# Altium project equalizerAndVoltageControl.PrjPcb
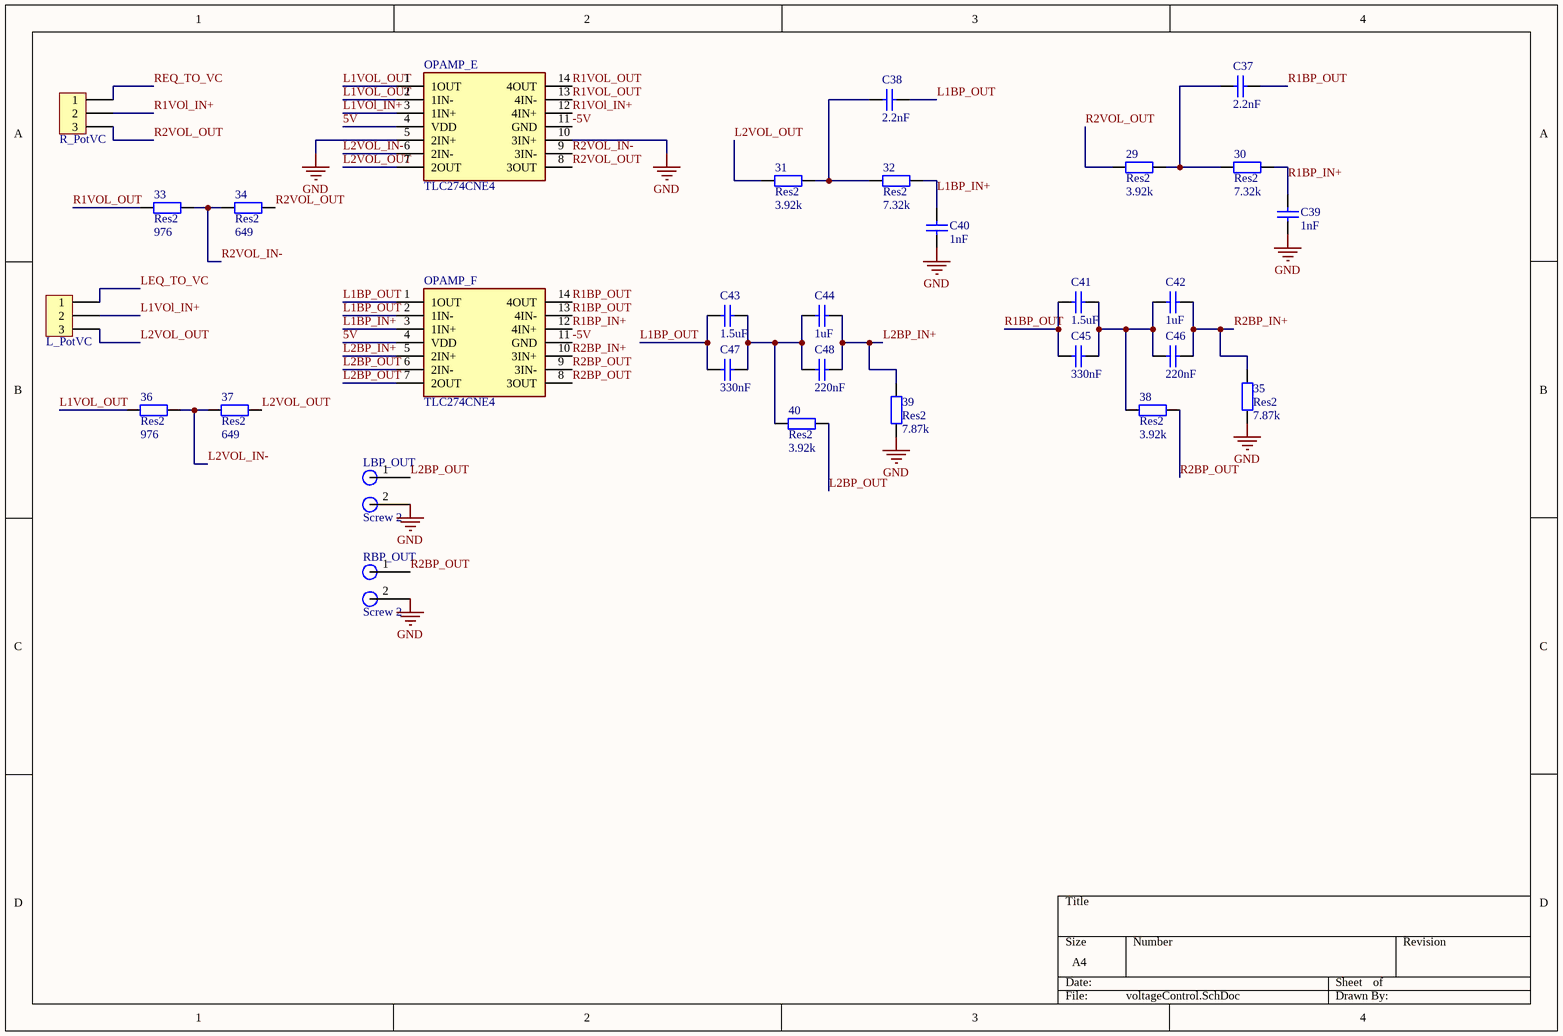
[diagram p0: voltageControl.SchDoc]
2 sheets, 121 parts. Net scope: global (net labels, ports and power ports of the same name join across sheets).
Board files: eqVcVersion1.PcbDoc, eqVcVersion2.PcbDoc
Sheets:
  voltageControl.SchDoc
  equalizer.SchDoc

## Sheet voltageControl.SchDoc
size A4; SheetNumber: 1; SheetTotal: 2

### Parts
29  Res2  value 3.92k  [AXIAL-0.4 PCBK]
30  Res2  value 7.32k  [AXIAL-0.4 PCBK]
31  Res2  value 3.92k  [AXIAL-0.4 PCBK]
32  Res2  value 7.32k  [AXIAL-0.4 PCBK]
33  Res2  value 976  [AXIAL-0.4 PCBK]
34  Res2  value 649  [AXIAL-0.4 PCBK]
35  Res2  value 7.87k  [AXIAL-0.4 PCBK]
36  Res2  value 976  [AXIAL-0.4 PCBK]
37  Res2  value 649  [AXIAL-0.4 PCBK]
38  Res2  value 3.92k  [AXIAL-0.4 PCBK]
39  Res2  value 7.87k  [AXIAL-0.4 PCBK]
40  Res2  value 3.92k  [AXIAL-0.4 PCBK]
C37  Capacity: 2.2nF  [Cap-1]  (hidden comment: Cap)
C38  Capacity: 2.2nF  [Cap-1]  (hidden comment: Cap)
C39  Capacity: 1nF  [Cap-1]  (hidden comment: Cap)
C40  Capacity: 1nF  [Cap-1]  (hidden comment: Cap)
C41  Capacity: 1.5uF  [Cap-1]  (hidden comment: Cap)
C42  Capacity: 1uF  [Cap-1]  (hidden comment: Cap)
C43  Capacity: 1.5uF  [Cap-1]  (hidden comment: Cap)
C44  Capacity: 1uF  [Cap-1]  (hidden comment: Cap)
C45  Capacity: 330nF  [Cap 20mm]  (hidden comment: Cap)
C46  Capacity: 220nF  [Cap-1]  (hidden comment: Cap)
C47  Capacity: 330nF  [Cap 20mm]  (hidden comment: Cap)
C48  Capacity: 220nF  [Cap-1]  (hidden comment: Cap)
L_PotVC  Header 1x3  [Header 1x3]  (value not drawn)
LBP_OUT  Screw 2  [Screw-2]
OPAMP_E  TLC274CNE4  [DIP794W53P254L1930H508Q14N]
OPAMP_F  TLC274CNE4  [DIP794W53P254L1930H508Q14N]
R_PotVC  Header 1x3  [Header 1x3]  (value not drawn)
RBP_OUT  Screw 2  [Screw-2]

### Nets
GND: 35.1 39.1 C39.1 C40.1 LBP_OUT.2 OPAMP_E.5(2IN+) OPAMP_E.10(3IN+) RBP_OUT.2
5V: OPAMP_E.4(VDD) OPAMP_F.4(VDD)
-5V: OPAMP_E.11(GND) OPAMP_F.11(GND)
L1BP_IN+: 32.2 C40.2(g) OPAMP_F.3(1IN+)
L1BP_OUT: C38.2(g) C43.1 C47.1 OPAMP_F.1(1OUT) OPAMP_F.2(1IN-)
L1VOl_IN+: L_PotVC.2 OPAMP_E.3(1IN+)
L1VOL_OUT: 36.1 OPAMP_E.1(1OUT) OPAMP_E.2(1IN-)
L2BP_IN+: 39.2 C44.2(g) C48.2(g) OPAMP_F.5(2IN+)
L2BP_OUT: 40.2 LBP_OUT.1 OPAMP_F.6(2IN-) OPAMP_F.7(2OUT)
L2VOL_IN-: 36.2 37.1 OPAMP_E.6(2IN-)
L2VOL_OUT: 31.1 37.2 L_PotVC.3 OPAMP_E.7(2OUT)
LEQ_TO_VC: L_PotVC.1
R1BP_IN+: 30.2 C39.2(g) OPAMP_F.12(4IN+)
R1BP_OUT: C37.2(g) C41.1 C45.1 OPAMP_F.13(4IN-) OPAMP_F.14(4OUT)
R1VOl_IN+: OPAMP_E.12(4IN+) R_PotVC.2
R1VOL_OUT: 33.1 OPAMP_E.13(4IN-) OPAMP_E.14(4OUT)
R2BP_IN+: 35.2 C42.2(g) C46.2(g) OPAMP_F.10(3IN+)
R2BP_OUT: 38.2 OPAMP_F.8(3OUT) OPAMP_F.9(3IN-) RBP_OUT.1
R2VOL_IN-: 33.2 34.1 OPAMP_E.9(3IN-)
R2VOL_OUT: 29.1 34.2 OPAMP_E.8(3OUT) R_PotVC.3
REQ_TO_VC: R_PotVC.1
Net29_2: 29.2 30.1 C37.1
Net31_2: 31.2 32.1 C38.1
Net38_1: 38.1 C41.2(g) C42.1 C45.2(g) C46.1
Net40_1: 40.1 C43.2(g) C44.1 C47.2(g) C48.1

### Library data of the parts
29-40 = Res PCBK: Resistor; Published: 8-Jun-2000; LatestRevisionDate: 17-Jul-2002; LatestRevisionNote: Re-released for DXP Platform.; PackageReference: AXIAL-0.4; Publisher: Altium Limited
C37-C44 C46 C48 = Capacitor 1 space
C45 C47 = Capacitor big ceramic
OPAMP_E OPAMP_F = TLC274CNE4: Precision Amplifiers Quad Single Supply Op Amp; Manufacturer_Name: Texas Instruments; Geometry.Height: 5.08mm; Mouser Part Number: 595-TLC274CNE4; Mouser Price/Stock: https://www.mouser.co.uk/ProductDetail/Texas-Instruments/TLC274CNE4?qs=Mkt%2FZhxPIiTvMsNXR1cCkw%3D%3D; Manufacturer_Part_Number: TLC274CNE4; Datasheet Link: https://www.ti.com/lit/ds/symlink/tlc274.pdf?ts=1639464334605&ref_url=https%253A%252F%252Fwww.ti.com%252Fstore%252Fti%252Fen%252Fp%252Fproduct%252F%253Fp%253DTLC274CN

## Sheet equalizer.SchDoc
size A4; SheetNumber: 2; SheetTotal: 2
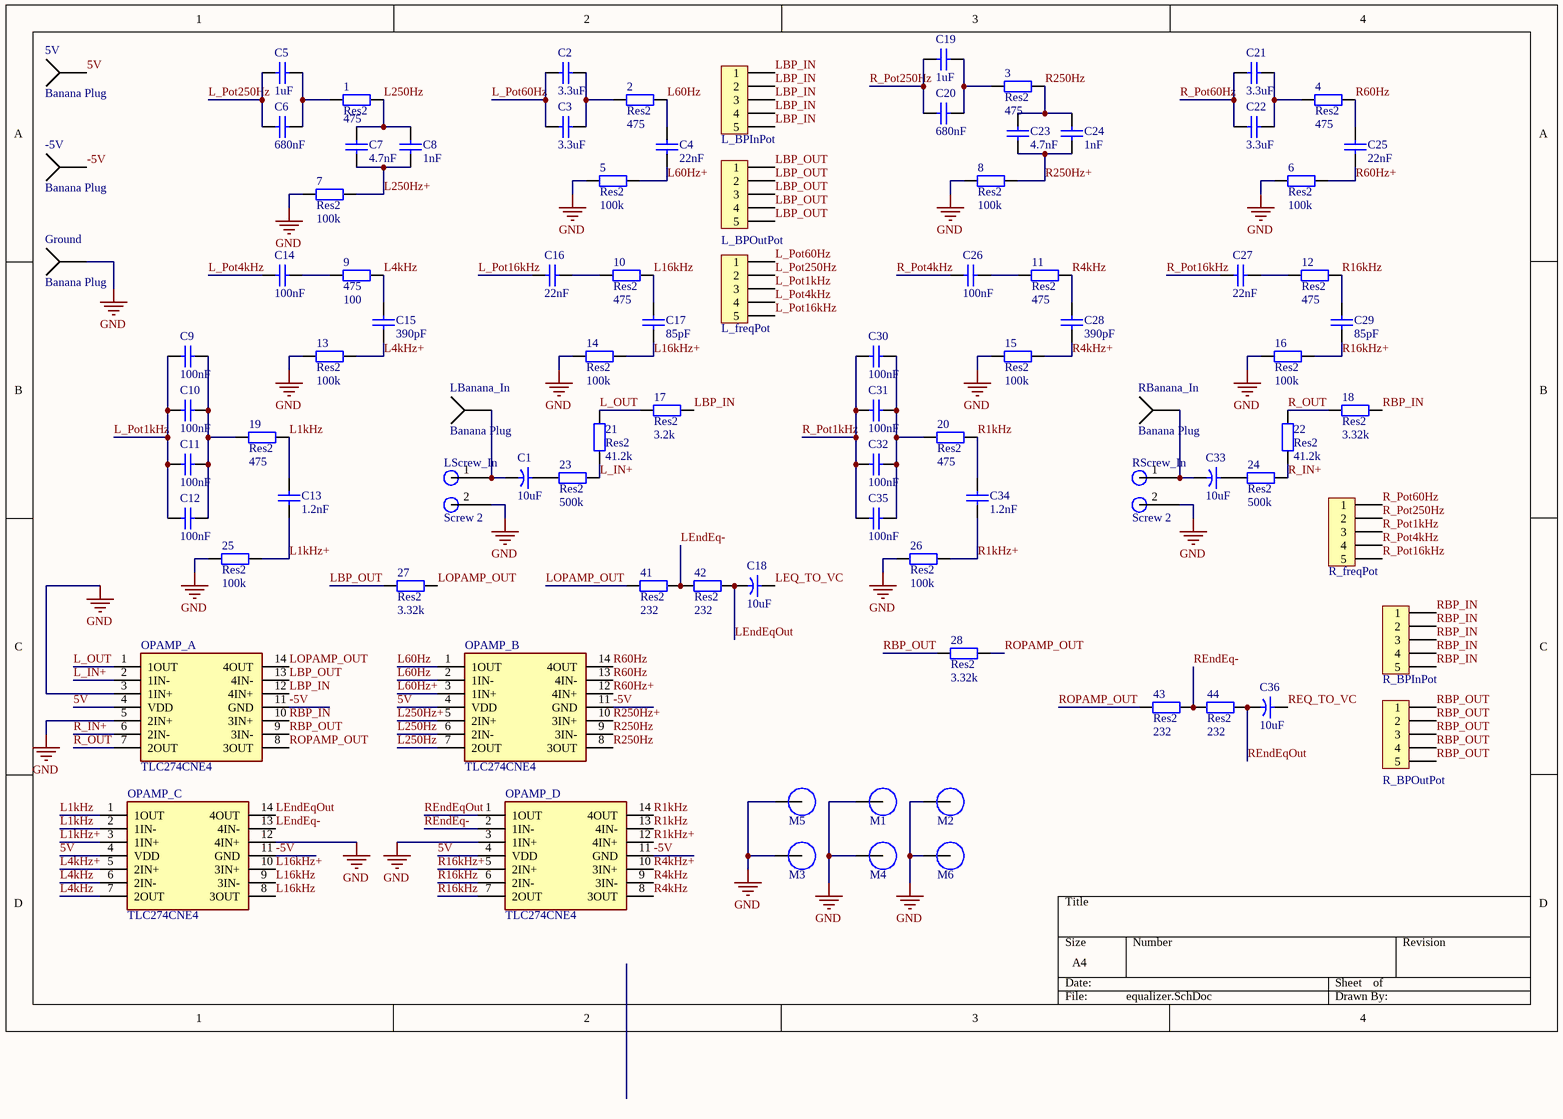
[diagram p1: equalizer.SchDoc]

### Parts
1  Res2  value 475  [AXIAL-0.4 PCBK]
2  Res2  value 475  [AXIAL-0.4 PCBK]
3  Res2  value 475  [AXIAL-0.4 PCBK]
4  Res2  value 475  [AXIAL-0.4 PCBK]
5  Res2  value 100k  [AXIAL-0.4 PCBK]
5V  Banana Plug  [Banana Plug On top]
6  Res2  value 100k  [AXIAL-0.4 PCBK]
7  Res2  value 100k  [AXIAL-0.4 PCBK]
8  Res2  value 100k  [AXIAL-0.4 PCBK]
9  475  value 100  [AXIAL-0.4 PCBK]
10  Res2  value 475  [AXIAL-0.4 PCBK]
11  Res2  value 475  [AXIAL-0.4 PCBK]
12  Res2  value 475  [AXIAL-0.4 PCBK]
13  Res2  value 100k  [AXIAL-0.4 PCBK]
14  Res2  value 100k  [AXIAL-0.4 PCBK]
15  Res2  value 100k  [AXIAL-0.4 PCBK]
16  Res2  value 100k  [AXIAL-0.4 PCBK]
17  Res2  value 3.2k  [AXIAL-0.4 PCBK]
18  Res2  value 3.32k  [AXIAL-0.4 PCBK]
19  Res2  value 475  [AXIAL-0.4 PCBK]
20  Res2  value 475  [AXIAL-0.4 PCBK]
21  Res2  value 41.2k  [AXIAL-0.4 PCBK]
22  Res2  value 41.2k  [AXIAL-0.4 PCBK]
23  Res2  value 500k  [AXIAL-0.4 PCBK]
24  Res2  value 500k  [AXIAL-0.4 PCBK]
25  Res2  value 100k  [AXIAL-0.4 PCBK]
26  Res2  value 100k  [AXIAL-0.4 PCBK]
27  Res2  value 3.32k  [AXIAL-0.4 PCBK]
28  Res2  value 3.32k  [AXIAL-0.4 PCBK]
41  Res2  value 232  [AXIAL-0.4 PCBK]
42  Res2  value 232  [AXIAL-0.4 PCBK]
43  Res2  value 232  [AXIAL-0.4 PCBK]
44  Res2  value 232  [AXIAL-0.4 PCBK]
-5V  Banana Plug  [Banana Plug On top]
C1  Capacity: 10uF  [RES THT 9mm]  (hidden comment: Cap)
C2  Capacity: 3.3uF  [Cap 20mm]  (hidden comment: Cap)
C3  Capacity: 3.3uF  [Cap 20mm]  (hidden comment: Cap)
C4  Capacity: 22nF  [Cap-1]  (hidden comment: Cap)
C5  Capacity: 1uF  [Cap-1]  (hidden comment: Cap)
C6  Capacity: 680nF  [Cap-1]  (hidden comment: Cap)
C7  Capacity: 4.7nF  [Cap-0]  (hidden comment: Cap)
C8  Capacity: 1nF  [Cap-0]  (hidden comment: Cap)
C9  Capacity: 100nF  [Cap-1]  (hidden comment: Cap)
C10  Capacity: 100nF  [Cap-1]  (hidden comment: Cap)
C11  Capacity: 100nF  [Cap-1]  (hidden comment: Cap)
C12  Capacity: 100nF  [Cap-1]  (hidden comment: Cap)
C13  Capacity: 1.2nF  [Cap-1]  (hidden comment: Cap)
C14  Capacity: 100nF  [Cap-1]  (hidden comment: Cap)
C15  Capacity: 390pF  [Cap-0]  (hidden comment: Cap)
C16  Capacity: 22nF  [Cap-1]  (hidden comment: Cap)
C17  Capacity: 85pF  [Cap-0]  (hidden comment: Cap)
C18  Capacity: 10uF  [RES THT 9mm]  (hidden comment: Cap)
C19  Capacity: 1uF  [Cap-1]  (hidden comment: Cap)
C20  Capacity: 680nF  [Cap-1]  (hidden comment: Cap)
C21  Capacity: 3.3uF  [Cap 20mm]  (hidden comment: Cap)
C22  Capacity: 3.3uF  [Cap 20mm]  (hidden comment: Cap)
C23  Capacity: 4.7nF  [Cap-0]  (hidden comment: Cap)
C24  Capacity: 1nF  [Cap-0]  (hidden comment: Cap)
C25  Capacity: 22nF  [Cap-1]  (hidden comment: Cap)
C26  Capacity: 100nF  [Cap-1]  (hidden comment: Cap)
C27  Capacity: 22nF  [Cap-1]  (hidden comment: Cap)
C28  Capacity: 390pF  [Cap-0]  (hidden comment: Cap)
C29  Capacity: 85pF  [Cap-0]  (hidden comment: Cap)
C30  Capacity: 100nF  [Cap-1]  (hidden comment: Cap)
C31  Capacity: 100nF  [Cap-1]  (hidden comment: Cap)
C32  Capacity: 100nF  [Cap-1]  (hidden comment: Cap)
C33  Capacity: 10uF  [RES THT 9mm]  (hidden comment: Cap)
C34  Capacity: 1.2nF  [Cap-1]  (hidden comment: Cap)
C35  Capacity: 100nF  [Cap-1]  (hidden comment: Cap)
C36  Capacity: 10uF  [RES THT 9mm]  (hidden comment: Cap)
Ground  Banana Plug  [Banana Plug On top]
L_BPInPot  Header 1x5  [Header 1x5]  (value not drawn)
L_BPOutPot  Header 1x5  [Header 1x5]  (value not drawn)
L_freqPot  Header 1x5  [Header 1x5]  (value not drawn)
LBanana_In  Banana Plug  [Banana Plug On top]
LScrew_In  Screw 2  [Screw-2]
M1  Screw Hole  [M8 HOLE]  (value not drawn)
M2  Screw Hole  [M8 HOLE]  (value not drawn)
M3  Screw Hole  [M8 HOLE]  (value not drawn)
M4  Screw Hole  [M8 HOLE]  (value not drawn)
M5  Screw Hole  [M8 HOLE]  (value not drawn)
M6  Screw Hole  [M8 HOLE]  (value not drawn)
OPAMP_A  TLC274CNE4  [DIP794W53P254L1930H508Q14N]
OPAMP_B  TLC274CNE4  [DIP794W53P254L1930H508Q14N]
OPAMP_C  TLC274CNE4  [DIP794W53P254L1930H508Q14N]
OPAMP_D  TLC274CNE4  [DIP794W53P254L1930H508Q14N]
R_BPInPot  Header 1x5  [Header 1x5]  (value not drawn)
R_BPOutPot  Header 1x5  [Header 1x5]  (value not drawn)
R_freqPot  Header 1x5  [Header 1x5]  (value not drawn)
RBanana_In  Banana Plug  [Banana Plug On top]
RScrew_In  Screw 2  [Screw-2]

### Nets
GND: 5.1 6.1 7.1 8.1 13.1 14.1 15.1 16.1 25.1 26.1 Ground.1 LScrew_In.2 M1.1 M2.1 M3.1 M4.1 M5.1 M6.1 OPAMP_A.3(1IN+) OPAMP_A.5(2IN+) OPAMP_C.12(4IN+) OPAMP_D.3(1IN+) RScrew_In.2
5V: 5V.1 OPAMP_A.4(VDD) OPAMP_B.4(VDD) OPAMP_C.4(VDD) OPAMP_D.4(VDD)
-5V: -5V.1 OPAMP_A.11(GND) OPAMP_B.11(GND) OPAMP_C.11(GND) OPAMP_D.11(GND)
L1kHz: 19.2 C13.2(g) OPAMP_C.1(1OUT) OPAMP_C.2(1IN-)
L1kHz+: 25.2 C13.1 OPAMP_C.3(1IN+)
L4kHz: 9.2 C15.2(g) OPAMP_C.6(2IN-) OPAMP_C.7(2OUT)
L4kHz+: 13.2 C15.1 OPAMP_C.5(2IN+)
L16kHz: 10.2 C17.2(g) OPAMP_C.8(3OUT) OPAMP_C.9(3IN-)
L16kHz+: 14.2 C17.1 OPAMP_C.10(3IN+)
L60Hz: 2.2 C4.2(g) OPAMP_B.1(1OUT) OPAMP_B.2(1IN-)
L60Hz+: 5.2 C4.1 OPAMP_B.3(1IN+)
L250Hz: 1.2 C7.2(g) C8.2(g) OPAMP_B.6(2IN-) OPAMP_B.7(2OUT)
L250Hz+: 7.2 C7.1 C8.1 OPAMP_B.5(2IN+)
L_IN+: 21.1 23.2 OPAMP_A.2(1IN-)
L_OUT: 17.1 21.2 OPAMP_A.1(1OUT)
L_Pot1kHz: C9.1 C10.1 C11.1 C12.1 L_freqPot.3
L_Pot4kHz: C14.1 L_freqPot.4
L_Pot16kHz: C16.1 L_freqPot.5
L_Pot60Hz: C2.1 C3.1 L_freqPot.1
L_Pot250Hz: C5.2(g) C6.2(g) L_freqPot.2
LBP_IN: 17.2 L_BPInPot.1 L_BPInPot.2 L_BPInPot.3 L_BPInPot.4 L_BPInPot.5 OPAMP_A.12(4IN+)
LBP_OUT: 27.1 L_BPOutPot.1 L_BPOutPot.2 L_BPOutPot.3 L_BPOutPot.4 L_BPOutPot.5 OPAMP_A.13(4IN-)
LEndEq-: 41.2 42.1 OPAMP_C.13(4IN-)
LEndEqOut: 42.2 C18.2(g) OPAMP_C.14(4OUT)
LEQ_TO_VC: C18.1
LOPAMP_OUT: 27.2 41.1 OPAMP_A.14(4OUT)
R1kHz: 20.2 C34.2(g) OPAMP_D.13(4IN-) OPAMP_D.14(4OUT)
R1kHz+: 26.2 C34.1 OPAMP_D.12(4IN+)
R4kHz: 11.2 C28.2(g) OPAMP_D.8(3OUT) OPAMP_D.9(3IN-)
R4kHz+: 15.2 C28.1 OPAMP_D.10(3IN+)
R16kHz: 12.2 C29.2(g) OPAMP_D.6(2IN-) OPAMP_D.7(2OUT)
R16kHz+: 16.2 C29.1 OPAMP_D.5(2IN+)
R60Hz: 4.2 C25.2(g) OPAMP_B.13(4IN-) OPAMP_B.14(4OUT)
R60Hz+: 6.2 C25.1 OPAMP_B.12(4IN+)
R250Hz: 3.2 C23.2(g) C24.2(g) OPAMP_B.8(3OUT) OPAMP_B.9(3IN-)
R250Hz+: 8.2 C23.1 C24.1 OPAMP_B.10(3IN+)
R_IN+: 22.1 24.2 OPAMP_A.6(2IN-)
R_OUT: 18.1 22.2 OPAMP_A.7(2OUT)
R_Pot1kHz: C30.1 C31.1 C32.1 C35.1 R_freqPot.3
R_Pot4kHz: C26.1 R_freqPot.4
R_Pot16kHz: C27.1 R_freqPot.5
R_Pot60Hz: C21.1 C22.1 R_freqPot.1
R_Pot250Hz: C19.2(g) C20.2(g) R_freqPot.2
RBP_IN: 18.2 OPAMP_A.10(3IN+) R_BPInPot.1 R_BPInPot.2 R_BPInPot.3 R_BPInPot.4 R_BPInPot.5
RBP_OUT: 28.1 OPAMP_A.9(3IN-) R_BPOutPot.1 R_BPOutPot.2 R_BPOutPot.3 R_BPOutPot.4 R_BPOutPot.5
REndEq-: 43.2 44.1 OPAMP_D.2(1IN-)
REndEqOut: 44.2 C36.2(g) OPAMP_D.1(1OUT)
REQ_TO_VC: C36.1
ROPAMP_OUT: 28.2 43.1 OPAMP_A.8(3OUT)
Net1_1: 1.1 C5.1 C6.1
Net2_1: 2.1 C2.2(g) C3.2(g)
Net3_1: 3.1 C19.1 C20.1
Net4_1: 4.1 C21.2(g) C22.2(g)
Net9_1: 9.1 C14.2(g)
Net10_1: 10.1 C16.2(g)
Net11_1: 11.1 C26.2(g)
Net12_1: 12.1 C27.2(g)
Net19_1: 19.1 C9.2(g) C10.2(g) C11.2(g) C12.2(g)
Net20_1: 20.1 C30.2(g) C31.2(g) C32.2(g) C35.2(g)
Net23_1: 23.1 C1.1
Net24_1: 24.1 C33.1
NetC1_2: C1.2(g) LBanana_In.1 LScrew_In.1
NetC33_2: C33.2(g) RBanana_In.1 RScrew_In.1

### Library data of the parts
1-28 41-44 = Res PCBK: Resistor; Published: 8-Jun-2000; LatestRevisionDate: 17-Jul-2002; LatestRevisionNote: Re-released for DXP Platform.; PackageReference: AXIAL-0.4; Publisher: Altium Limited
C1 C18 C33 C36 = Capacitor Polarised
C2 C3 C21 C22 = Capacitor big ceramic
C4-C6 C9-C14 C16 C19 C20 C25-C27 C30-C32 C34 C35 = Capacitor 1 space
C7 C8 C15 C17 C23 C24 C28 C29 = Capacitor 0 space
OPAMP_A OPAMP_B OPAMP_C OPAMP_D = TLC274CNE4: as OPAMP_E on sheet voltageControl; Mouser Part Number: 595-TLC274CNE4; Mouser Price/Stock: https://www.mouser.co.uk/ProductDetail/Texas-Instruments/TLC274CNE4?qs=Mkt%2FZhxPIiTvMsNXR1cCkw%3D%3D; Manufacturer_Part_Number: TLC274CNE4; Datasheet Link: https://www.ti.com/lit/ds/symlink/tlc274.pdf?ts=1639464334605&ref_url=https%253A%252F%252Fwww.ti.com%252Fstore%252Fti%252Fen%252Fp%252Fproduct%252F%253Fp%253DTLC274CN

## Nets that join several sheets
GND: voltageControl (8 pins), equalizer (23 pins)
5V: voltageControl (OPAMP_E.4 OPAMP_F.4), equalizer (5 pins)
-5V: voltageControl (OPAMP_E.11 OPAMP_F.11), equalizer (5 pins)
LEQ_TO_VC: voltageControl (L_PotVC.1), equalizer (C18.1)
REQ_TO_VC: voltageControl (R_PotVC.1), equalizer (C36.1)